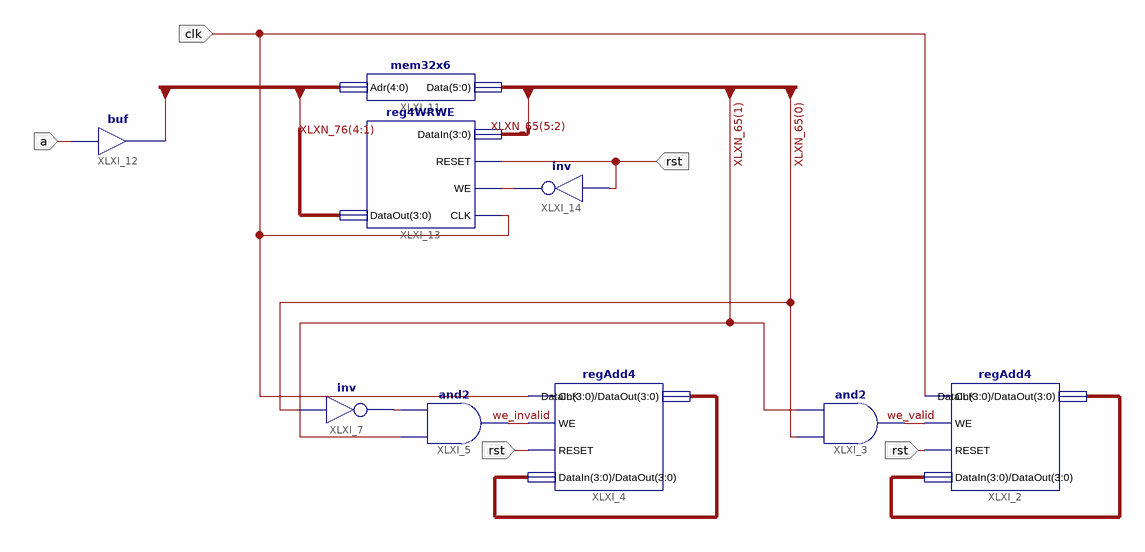
[diagram p0: schematic sheet 1]
// Xilinx ISE schematic Aufgabe2d.sch (spartan3e) as structural Verilog: 9 symbols, 3 ports
module Aufgabe2d (
  input  rst,
  input  clk,
  input  a
);

  wire we_invalid, we_valid, XLXN_24, XLXN_86;
  wire [3:0] XLXN_34, XLXN_35;
  wire [4:0] XLXN_76;
  wire [5:0] XLXN_65;

  regAdd4 XLXI_2 (.CLK(clk), .WE(we_valid), .RESET(rst), .DataIn(XLXN_35), .DataOut(XLXN_35));
  and XLXI_3 (we_valid, XLXN_65[0], XLXN_65[1]);
  regAdd4 XLXI_4 (.CLK(clk), .WE(we_invalid), .RESET(rst), .DataIn(XLXN_34), .DataOut(XLXN_34));
  and XLXI_5 (we_invalid, XLXN_65[1], XLXN_24);
  not XLXI_7 (XLXN_24, XLXN_65[0]);
  mem32x6 XLXI_11 (.Adr(XLXN_76), .Data(XLXN_65));
  buf XLXI_12 (XLXN_76[0], a);
  reg4WRWE XLXI_13 (.CLK(clk), .WE(XLXN_86), .RESET(rst), .DataIn(XLXN_65[5:2]), .DataOut(XLXN_76[4:1]));
  not XLXI_14 (XLXN_86, rst);
endmodule
